# EAGLE design sBoardUS+ (EAGLE 6.5.0)
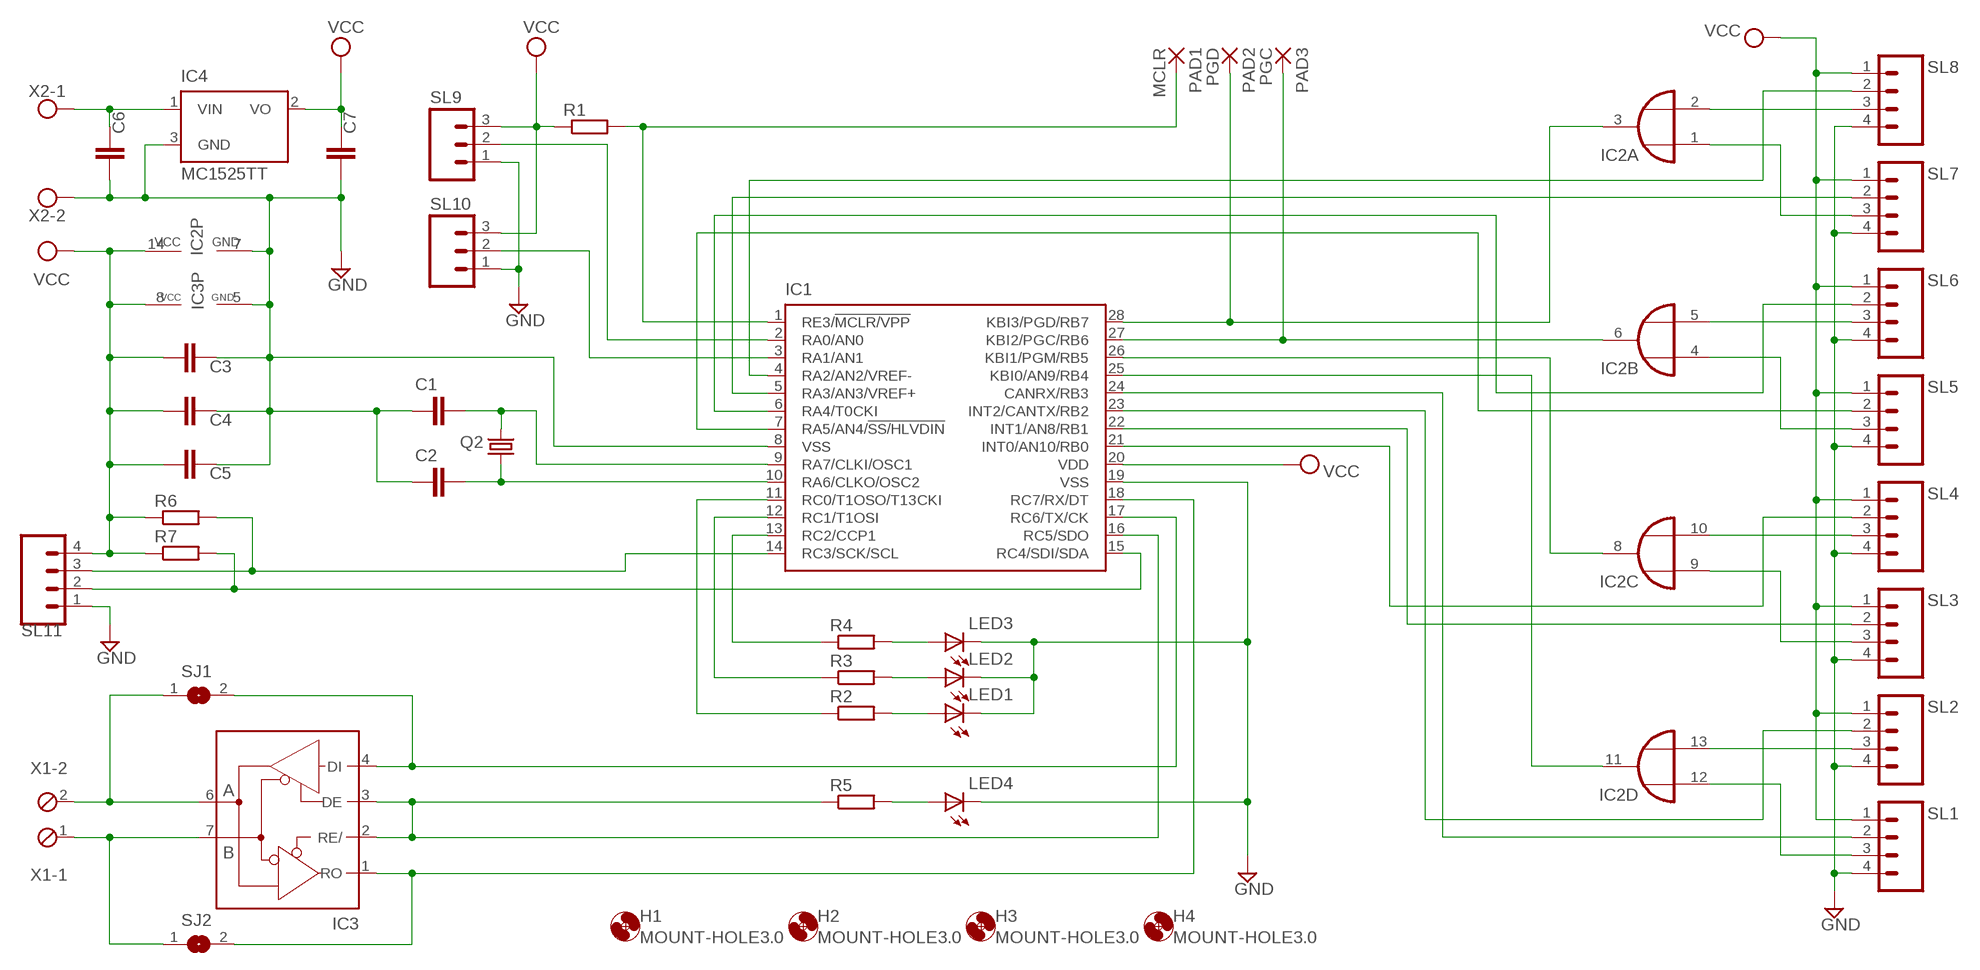
[diagram p0: schematic, sheet 1]

## Parts
C1  C-EUC0805  [C0805]
C2  C-EUC0805  [C0805]
C3  C-EUC0805  [C0805]
C4  C-EUC0805  [C0805]
C5  C-EUC0805  [C0805]
C6  C-EUC0805  [C0805]
C7  C-EUC0805  [C0805]
H1  MOUNT-HOLE3.0  [3,0]
H2  MOUNT-HOLE3.0  [3,0]
H3  MOUNT-HOLE3.0  [3,0]
H4  MOUNT-HOLE3.0  [3,0]
IC1  PIC18F2580-E/SO  [SO28W]
IC2  74AC32D  [SO14]
IC3  MAX481CSA  [SO08]
IC4  MC1525TT  [SOT23]
LED1  LED  [SMARTLED-TTW]
LED2  LED  [SMARTLED-TTW]
LED3  LED  [SMARTLED-TTW]
LED4  LED  [SMARTLED-TTW]
PAD1  MCLR  SMD2  [SMD1,27-2,54]
PAD2  PGD  SMD2  [SMD1,27-2,54]
PAD3  PGC  SMD2  [SMD1,27-2,54]
Q2  CRYSTALHC49U-V  [HC49U-V]
R1  R-EU_R0805  [R0805]
R2  R-EU_R0805  [R0805]
R3  R-EU_R0805  [R0805]
R4  R-EU_R0805  [R0805]
R5  R-EU_R0805  [R0805]
R6  R-EU_R0805  [R0805]
R7  R-EU_R0805  [R0805]
SJ1  SJ  [SJ]
SJ2  SJ  [SJ]
SL1  M04  [04P]
SL2  M04  [04P]
SL3  M04  [04P]
SL4  M04  [04P]
SL5  M04  [04P]
SL6  M04  [04P]
SL7  M04  [04P]
SL8  M04  [04P]
SL9  M03  [03P]
SL10  M03  [03P]
SL11  M04  [04P]
X1  MPT2  [2POL254]
X2  AK500/2  [AK500/2]

## Nets
GND: C1.1 C2.1 C3.1 C4.1 C5.1 C6.2 C7.2 IC1.8(VSS) IC1.19(VSS) IC2.7(P:GND) IC3.5(GND) IC4.3(GND) LED1.C@1(C) LED2.C@1(C) LED3.C@1(C) LED4.C@1(C) SL1.4 SL2.4 SL3.4 SL4.4 SL5.4 SL6.4 SL7.4 SL8.4 SL9.1 SL10.1 SL11.1 X2.2
N$1: C1.2 IC1.9(RA7/CLKI/OSC1) Q2.2
N$2: C2.2 IC1.10(RA6/CLKO/OSC2) Q2.1
N$3: IC2.2(A:I1) SL8.3
N$4: IC1.1(RE3/!MCLR/VPP) PAD1.1(P) R1.2
N$5: IC1.2(RA0/AN0) SL9.2
N$6: IC1.3(RA1/AN1) SL10.2
N$7: IC1.25(KBI0/AN9/RB4) IC2.11(D:O)
N$8: IC1.26(KBI1/PGM/RB5) IC2.8(C:O)
N$9: IC1.27(KBI2/PGC/RB6) IC2.6(B:O) PAD3.1(P)
N$10: IC1.28(KBI3/PGD/RB7) IC2.3(A:O) PAD2.1(P)
N$11: IC2.5(B:I1) SL6.3
N$12: IC2.10(C:I1) SL4.3
N$13: IC2.13(D:I1) SL2.3
N$14: IC2.1(A:I0) SL7.3
N$15: IC2.4(B:I0) SL5.3
N$16: IC2.9(C:I0) SL3.3
N$17: IC2.12(D:I0) SL1.3
N$18: IC1.22(INT1/AN8/RB1) SL3.2
N$19: IC1.5(RA3/AN3/VREF+) SL7.2
N$20: IC1.4(RA2/AN2/VREF-) SL8.2
N$21: IC1.6(RA4/T0CKI) SL6.2
N$22: IC1.7(RA5/AN4/!SS/HLVDIN) SL5.2
N$23: IC1.21(INT0/AN10/RB0) SL4.2
N$24: IC1.24(CANRX/RB3) SL1.2
N$25: IC3.6(A) SJ1.1 X1.2
N$26: IC3.7(B) SJ2.1 X1.1
N$27: IC1.16(RC5/SDO) IC3.2(RE/) IC3.3(DE) R5.1
N$28: IC1.17(RC6/TX/CK) IC3.4(DI) SJ1.2
N$29: IC1.18(RC7/RX/DT) IC3.1(RO) SJ2.2
N$30: IC1.23(INT2/CANTX/RB2) SL2.2
N$31: IC1.11(RC0/T1OSO/T13CKI) R2.1
N$32: IC1.12(RC1/T1OSI) R3.1
N$33: IC1.13(RC2/CCP1) R4.1
N$34: LED3.A@1(A) R4.2
N$35: LED2.A@1(A) R3.2
N$36: LED1.A@1(A) R2.2
N$37: C6.1 IC4.1(VIN) X2.1
N$38: LED4.A@1(A) R5.2
N$39: IC1.14(RC3/SCK/SCL) R6.2 SL11.3
N$40: IC1.15(RC4/SDI/SDA) R7.2 SL11.2
VCC: C3.2 C4.2 C5.2 C7.1 IC1.20(VDD) IC2.14(P:VCC) IC3.8(VCC) IC4.2(VO) R1.1 R6.1 R7.1 SL1.1 SL2.1 SL3.1 SL4.1 SL5.1 SL6.1 SL7.1 SL8.1 SL9.3 SL10.3 SL11.4

## Library data of the parts
C1-C7 = rcl:C-EU: CAPACITOR, European symbol
H1-H4 = holes:MOUNT-HOLE: MOUNTING HOLE with drill center marker
IC1 = microchip:PIC18F2*80: 28-Pin Enhanced Flash Microcontrollers with ECAN(TM) Technology 10-Bit A/D and nanoWatt Technology Source: http://www.microchip.com .. 39637a.pdf; MF: MICROCHIP; MPN: PIC18F2580-I/SO; OC_FARNELL: 9321284; OC_NEWARK: 71J7243
IC2 = 74xx-eu:74*32: Quad 2-input OR gate
IC3 = maxim:MAX481CSA: RS485 TRANSEIVER; MF: MAXIM; MPN: MAX481CSA; OC_FARNELL: unknown; OC_NEWARK: 90C3817
IC4 = microchip:MC15*: 2.5V and 4.096V Voltage References Source: http://www.microchip.com .. 21653b.pdf; OC_FARNELL: unknown; OC_NEWARK: unknown
LED1-LED4 = led:LED: LED OSRAM: - CHIPLED LG R971, LG N971, LY N971, LG Q971, LY Q971, LO R971, LY R971 LH N974, LH R974 LS Q976, LO Q976, LY Q976 LO Q996 - Hyper CHIPLED LW Q18S LB Q993, LB Q99A, LB R99A - SideLED LS A670, LO A670, LY A670, LG A670, LP A670 LB A673, LV A673, LT A673, LW A673 LH A674 LY A675 LS A676, LA A676, LO A676, LY A676, LW A676 LS A679, LY A679, LG A679 - Hyper Micro SIDELED® LS Y876, LA Y876, LO Y876, LY Y876 LT Y87S - SmartLED LW L88C, LW L88S LB L89C, LB L89S, LG L890 LS L89K, LO L89K, LY L89K LS L896, LA L896, LO L896, LY L896 - TOPLED LS T670, LO T670, LY T670, LG T670, LP T670 LSG T670, LSP T670, LSY T670, LOP T670, LYG T670 LG T671, LOG T671, LSG T671 LB T673, LV T673, LT T673, LW T673 LH T674 LS T676, LA T676, LO T676, LY T676, LB T676, LH T676, LSB T676, LW T676 LB T67C, LV T67C, LT T67C, LS T67K, LO T67K, LY T67K, LW E67C LS E67B, LA E67B, LO E67B, LY E67B, LB E67C, LV E67C, LT E67C LW T67C LS T679, LY T679, LG T679 LS T770, LO T770, LY T770, LG T770, LP T770 LB T773, LV T773, LT T773, LW T773 LH T774 LS E675, LA E675, LY E675, LS T675 LS T776, LA T776, LO T776, LY T776, LB T776 LHGB T686 LT T68C, LB T68C - Hyper Mini TOPLED® LB M676 - Mini TOPLED Santana® LG M470 LS M47K, LO M47K, LY M47K Source: http://www.osram.convergy.de LUXEON: - LUMILED® LXK2-PW12-R00, LXK2-PW12-S00, LXK2-PW14-U00, LXK2-PW14-V00 LXK2-PM12-R00, LXK2-PM12-S00, LXK2-PM14-U00 LXK2-PE12-Q00, LXK2-PE12-R00, LXK2-PE12-S00, LXK2-PE14-T00, LXK2-PE14-U00 LXK2-PB12-K00, LXK2-PB12-L00, LXK2-PB12-M00, LXK2-PB14-N00, LXK2-PB14-P00, LXK2-PB14-Q00 LXK2-PR12-L00, LXK2-PR12-M00, LXK2-PR14-Q00, LXK2-PR14-R00 LXK2-PD12-Q00, LXK2-PD12-R00, LXK2-PD12-S00 LXK2-PH12-R00, LXK2-PH12-S00 LXK2-PL12-P00, LXK2-PL12-Q00, LXK2-PL12-R00 Source: www.luxeon.com KINGBRIGHT: KA-3528ASYC Source: www.kingbright.com
PAD1-PAD3 = wirepad:SMD2: SMD PAD
Q2 = crystal:CRYSTAL: CRYSTAL; OC_FARNELL: 1666969; OC_NEWARK: unknown
R1-R7 = rcl:R-EU_: RESISTOR, European symbol
SJ1 SJ2 = jumper:SJ: SMD solder JUMPER
SL1-SL8 SL11 = con-amp-quick:M04: AMP QUICK CONNECTOR; OC_FARNELL: unknown; OC_NEWARK: unknown
SL9 SL10 = con-amp-quick:M03: AMP QUICK CONNECTOR; OC_FARNELL: unknown; OC_NEWARK: unknown
X1 = con-phoenix-254:MPT2: PHOENIX CONNECTOR; OC_FARNELL: unknown; OC_NEWARK: unknown
X2 = con-ptr500:AK500/2: CONNECTOR; OC_FARNELL: unknown; OC_NEWARK: unknown

## Board
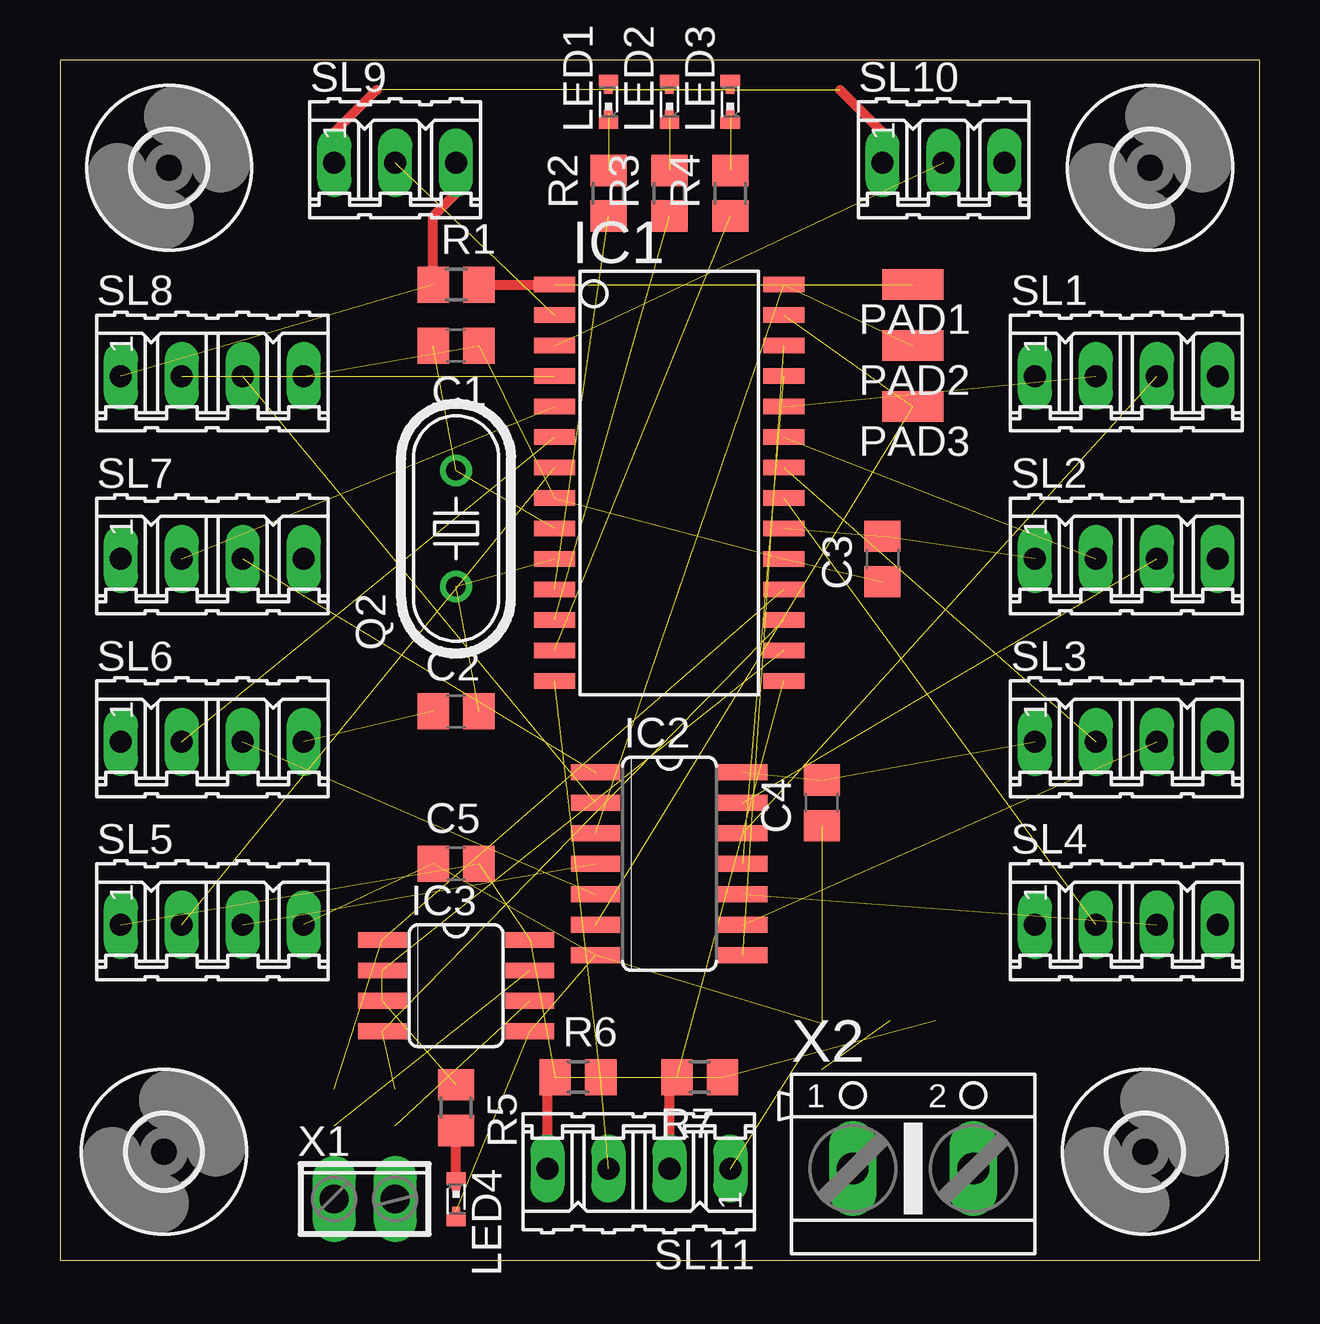
[diagram p1: board, top side]
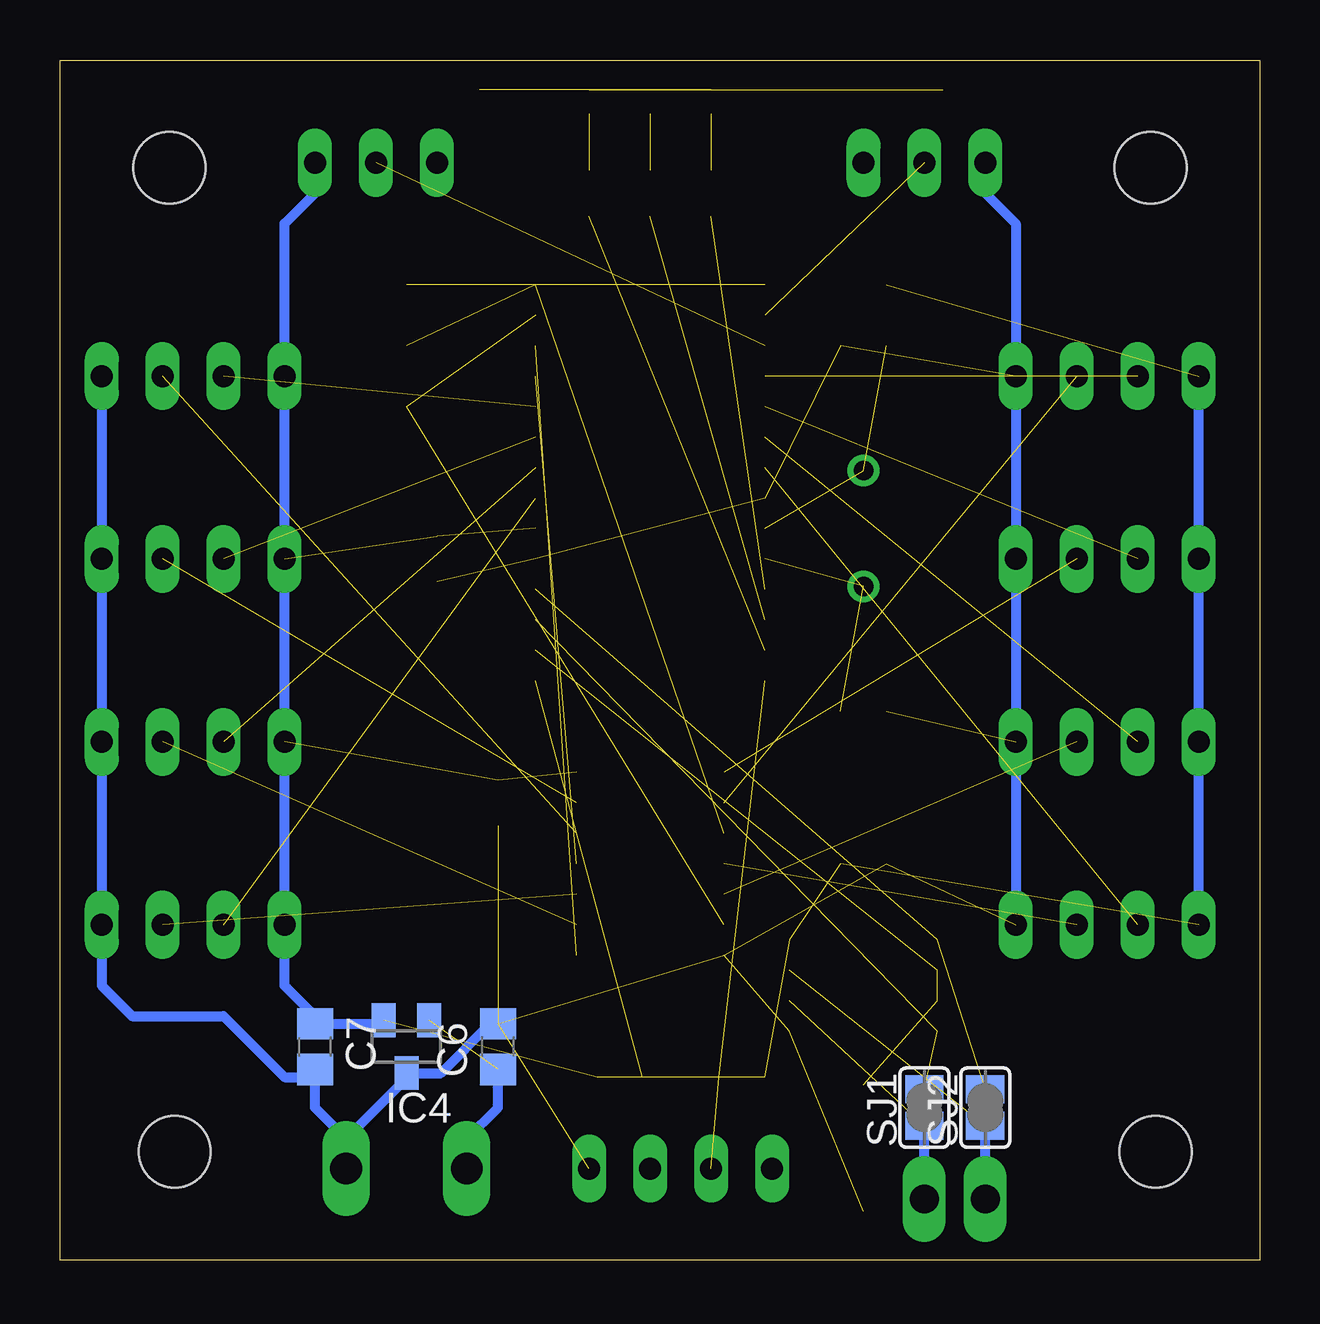
[diagram p2: board, bottom side, seen from below]

Size 50 x 50 mm. Coordinates in mm from the lower left corner, seen from the top.
Outline: 0,0 50,0 50,50 0,50 0,0
Copper layers (1*16): Top 0.035mm / dielectric 1.5mm / Bottom 0.035mm
Design rules "default": minimum track width 10mil, minimum drill 24mil, track to track 8mil, track to pad 8mil, pad to pad 8mil, via to via 8mil, smd to smd 8mil, copper to edge 40mil, drill to drill 8mil, minimum pad ring 10mil, minimum via ring 8mil, stop-mask expansion 4mil, vias tented up to drill 0mil, thermal gap 10mil

### Footprints (pad centres in the part's own frame; a part is rotated, then mirrored left to right if it is on the bottom)
C0805 = smd 1.3 x 1.5: 1 -0.95,0; 2 0.95,0
3,0 = hole 3: 0,0
SO28W = smd 0.65 x 1.7: 1 -7.62,-4.78; 2 -6.35,-4.78; 3 -5.08,-4.78; 4 -3.81,-4.78; 5 -2.54,-4.78; 6 -1.27,-4.78; 7 0,-4.78; 8 1.27,-4.78; 9 2.54,-4.78; 10 3.81,-4.78; 11 5.08,-4.78; 12 6.35,-4.78; 13 7.62,-4.78; 14 8.89,-4.78; 15 8.89,4.78; 16 7.62,4.78; 17 6.35,4.78; 18 5.08,4.78; 19 3.81,4.78; 20 2.54,4.78; 21 1.27,4.78; 22 0,4.78; 23 -1.27,4.78; 24 -2.54,4.78; 25 -3.81,4.78; 26 -5.08,4.78; 27 -6.35,4.78; 28 -7.62,4.78
SO14 = smd 0.66 x 2.032: 1 -3.81,-3.073; 2 -2.54,-3.073; 3 -1.27,-3.073; 4 0,-3.073; 5 1.27,-3.073; 6 2.54,-3.073; 7 3.81,-3.073; 8 3.81,3.073; 9 2.54,3.073; 10 1.27,3.073; 11 0,3.073; 12 -1.27,3.073; 13 -2.54,3.073; 14 -3.81,3.073
SO08 = smd 0.66 x 2.032: 1 -1.905,-3.073; 2 -0.635,-3.073; 3 0.635,-3.073; 4 1.905,-3.073; 5 1.905,3.073; 6 0.635,3.073; 7 -0.635,3.073; 8 -1.905,3.073
SOT23 = smd 1 x 1.4: 1 -0.95,-1.1; 2 0.95,-1.1; 3 0,1.1
SMARTLED-TTW = smd 0.8 x 0.5: A 0,-0.875; C 0,0.875 | smd 0.35 x 0.35: A@1 0,-0.5; C@1 0,0.5
SMD1,27-2,54 = smd 1.27 x 2.54: 1 0,0
HC49U-V = drill 0.813: 1 -2.413,0; 2 2.413,0
R0805 = smd 1.3 x 1.5: 1 -0.95,0; 2 0.95,0
SJ = smd 1.168 x 1.6: 1 -0.762,0; 2 0.762,0
04P = drill 0.914 long: 1 -3.81,0; 2 -1.27,0; 3 1.27,0; 4 3.81,0
03P = drill 0.914 long: 1 -2.54,0; 2 0,0; 3 2.54,0
2POL254 = drill 1.2 long: 1 -1.27,0; 2 1.27,0
AK500/2 = drill 1.321 long: 1 -2.515,0; 2 2.515,0

### Placement (x,y rotation side)
C1  16.51,38.1 180 top
C2  16.51,22.86 0 top
C3  34.29,29.21 90 top
C4  31.75,19.05 90 top
C5  16.51,16.51 0 top
C6  31.75,8.89 90 bottom
C7  39.37,8.89 270 bottom
H1  45.22,4.51 0 top
H2  4.33,4.51 0 top
H3  45.44,45.51 0 top
H4  4.55,45.51 0 top
IC1  25.4,33.02 270 top
IC2  25.4,16.51 270 top
IC3  16.51,11.43 270 top
IC4  35.56,8.89 180 bottom
LED1  22.86,48.26 0 top
LED2  25.4,48.26 0 top
LED3  27.94,48.26 0 top
LED4  16.51,2.54 180 top
PAD1  35.56,40.64 90 top
PAD2  35.56,38.1 90 top
PAD3  35.56,35.56 90 top
Q2  16.51,30.48 90 top
R1  16.51,40.64 0 top
R2  22.86,44.45 90 top
R3  25.4,44.45 90 top
R4  27.94,44.45 90 top
R5  16.51,6.35 270 top
R6  21.59,7.62 0 top
R7  26.67,7.62 180 top
SJ1  13.97,6.35 90 bottom
SJ2  11.43,6.35 90 bottom
SL1  44.45,36.83 0 top
SL2  44.45,29.21 0 top
SL3  44.45,21.59 0 top
SL4  44.45,13.97 0 top
SL5  6.35,13.97 0 top
SL6  6.35,21.59 0 top
SL7  6.35,29.21 0 top
SL8  6.35,36.83 0 top
SL9  13.97,45.72 0 top
SL10  36.83,45.72 0 top
SL11  24.13,3.81 180 top
X1  12.7,2.54 0 top
X2  35.56,3.81 0 top

### Tracks (layer width: path | path; a pad name or v marks a point on that pad's centre or on a via)
GND  (16 unrouted)
  Top 0.406: SL10.1 34.29,46.99 32.52,48.76 | 13.2,48.76 11.43,46.99 SL9.1
  Bottom 0.406: X2.2 38.08,5.05 | 38.08,5.05 39.37,6.35 C7.2 39.69,7.62 40.64,7.62 43.18,10.16 46.99,10.16 48.26,11.43 SL4.4 SL3.4 SL2.4 SL1.4 | 38.08,5.05 35.56,7.57 IC4.3 34.12,7.79 32.07,9.84 C6.2 | SL9.1 11.43,44.45 10.16,43.18 SL8.4 SL7.4 SL6.4 SL5.4
N$1  (2 unrouted)
N$2  (2 unrouted)
N$3  (1 unrouted)
N$4  (1 unrouted)
  Top 0.406: R1.2 IC1.1
N$5  (1 unrouted)
N$6  (1 unrouted)
N$7  (1 unrouted)
N$8  (1 unrouted)
N$9  (2 unrouted)
N$10  (2 unrouted)
N$11  (1 unrouted)
N$12  (1 unrouted)
N$13  (1 unrouted)
N$14  (1 unrouted)
N$15  (1 unrouted)
N$16  (1 unrouted)
N$17  (1 unrouted)
N$18  (1 unrouted)
N$19  (1 unrouted)
N$20  (1 unrouted)
N$21  (1 unrouted)
N$22  (1 unrouted)
N$23  (1 unrouted)
N$24  (1 unrouted)
N$25  (1 unrouted)
  Bottom 0.406: X1.2 SJ1.1
N$26  (1 unrouted)
  Bottom 0.406: X1.1 SJ2.1
N$27  (3 unrouted)
N$28  (2 unrouted)
N$29  (2 unrouted)
N$30  (1 unrouted)
N$31  (1 unrouted)
N$32  (1 unrouted)
N$33  (1 unrouted)
N$34  (1 unrouted)
N$35  (1 unrouted)
N$36  (1 unrouted)
N$37  (1 unrouted)
  Bottom 0.406: X2.1 33.05,5.05 31.75,6.35 C6.1
N$38
  Top 0.406: LED4.A@1 R5.2
N$39  (2 unrouted)
N$40  (1 unrouted)
  Top 0.406: SL11.2 25.4,7.3 R7.2
VCC  (10 unrouted)
  Top 0.406: SL11.4 20.32,7.3 R6.1 | R1.1 15.56,43.5 16.51,44.45 SL9.3
  Bottom 0.406: IC4.2 36.66,9.84 C7.1 39.37,10.16 40.64,11.43 SL4.1 SL3.1 SL2.1 SL1.1 40.64,43.18 39.37,44.45 SL10.3 | SL5.1 SL6.1 SL7.1 SL8.1